# Altium schematic sheet WITH_ADC.SchDoc: ESP32 + INMP441 WLED SHIELD
size A; Revision: 1; SheetNumber: 2; SheetTotal: 2
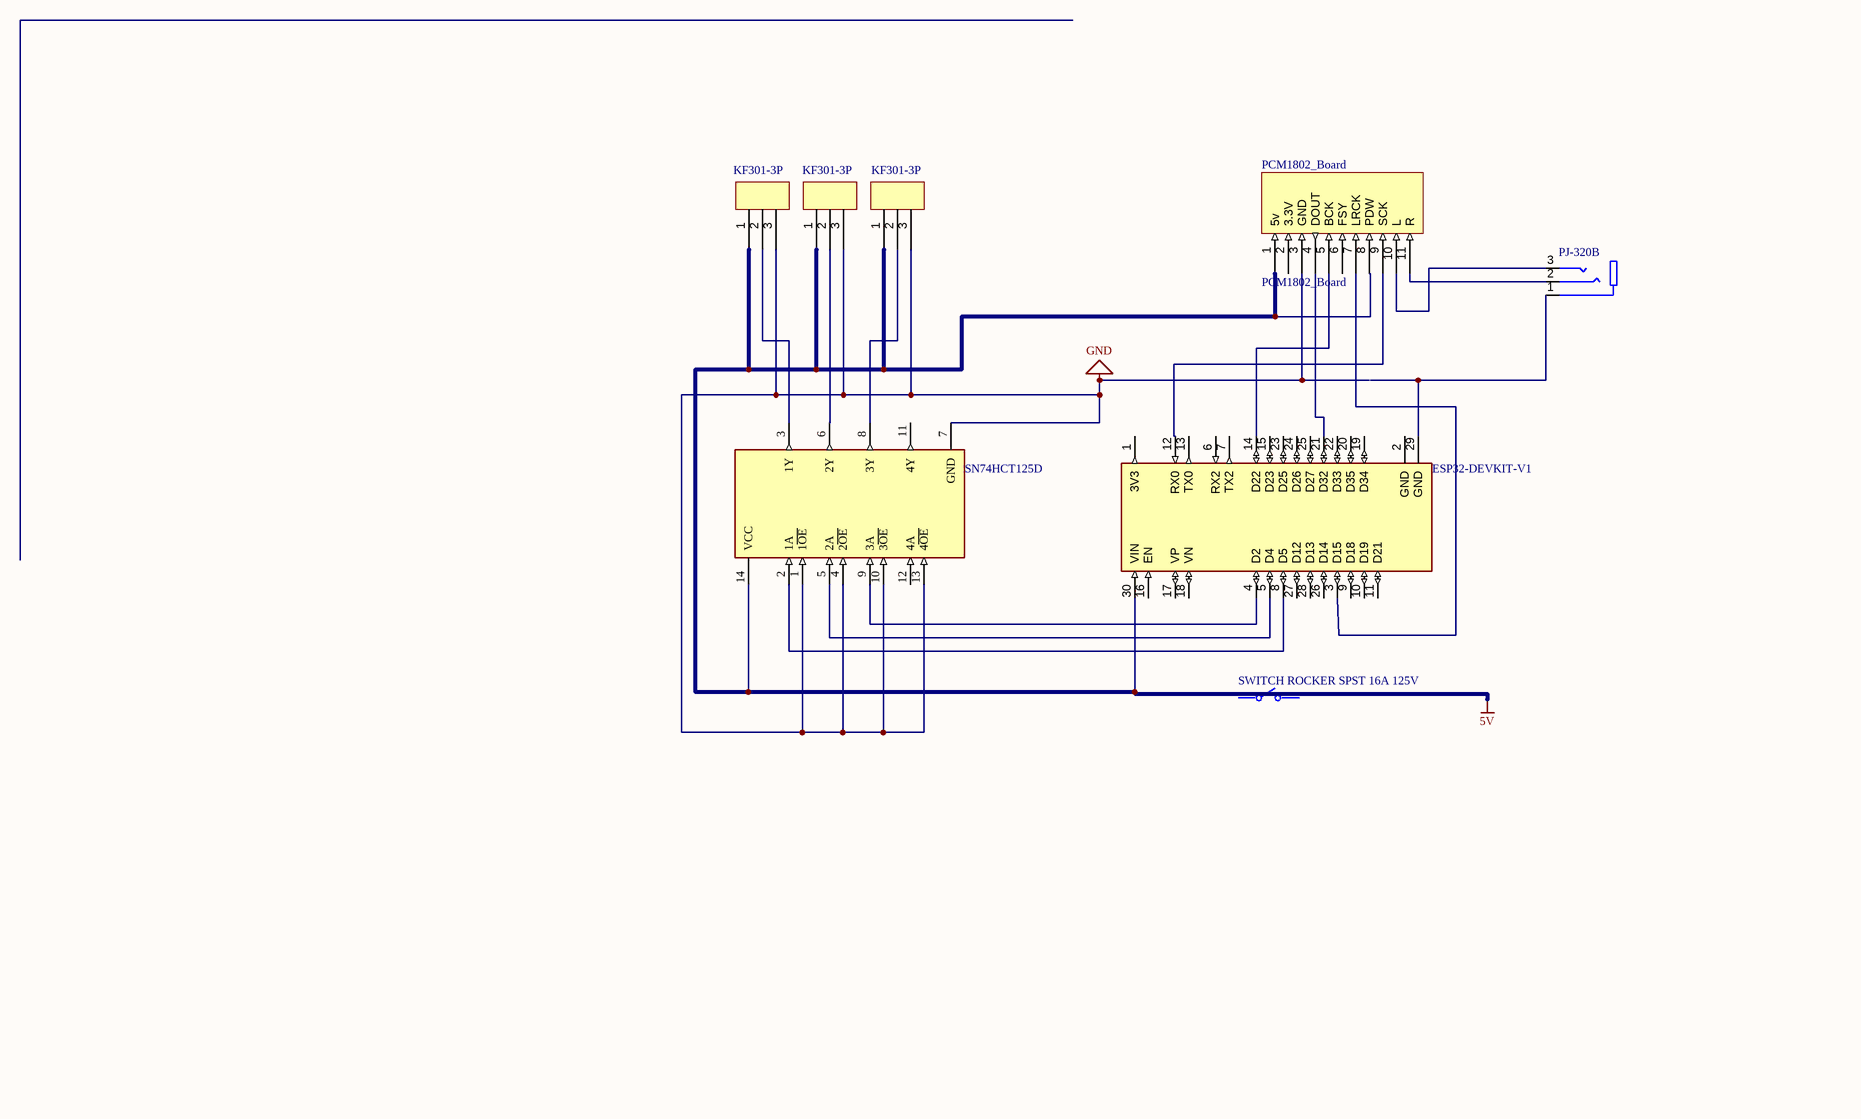
[diagram p0: WITH_ADC.SchDoc]

## Parts
(Parts that share a designator on the sheet are numbered #1, #2 ... from top to bottom, then left to right.)
ESP32-DEVKIT-V1  (no value)  [MODULE_ESP32_DEVKIT_V1]
KF301-3P#1  (no value)  (no BOM)
KF301-3P#2  (no value)  (no BOM)
KF301-3P#3  (no value)  (no BOM)
PCM1802_Board  PCM1802_Board
PJ-320B  (no value)  [BOOMELE_PJ-320B]
SN74HCT125D  (no value)  [FP-D0014A-IPC_C]
SWITCH_ROCKER_SPST_16A_125V  (no value)  [FP-PRASA1-16F-BB0BW-MFG]

## Nets
5V: ESP32-DEVKIT-V1.30(VIN) KF301-3P#1.1 KF301-3P#2.1 KF301-3P#3.1 PCM1802_Board.1(5v) PCM1802_Board.8(PDW) SN74HCT125D.14(VCC)
GND: KF301-3P#1.3 KF301-3P#2.3 KF301-3P#3.3 PCM1802_Board.3(GND) SN74HCT125D.1(1~{OE}) SN74HCT125D.4(2~{OE}) SN74HCT125D.7(GND) SN74HCT125D.10(3~{OE}) SN74HCT125D.13(4~{OE})
NetESP32-DEVKIT-V1_3: ESP32-DEVKIT-V1.3(D15) PCM1802_Board.7(LRCK)
NetESP32-DEVKIT-V1_4: ESP32-DEVKIT-V1.4(D2) SN74HCT125D.9(3A)
NetESP32-DEVKIT-V1_5: ESP32-DEVKIT-V1.5(D4) SN74HCT125D.5(2A)
NetESP32-DEVKIT-V1_8: ESP32-DEVKIT-V1.8(D5) SN74HCT125D.2(1A)
NetESP32-DEVKIT-V1_12: ESP32-DEVKIT-V1.12(RX0) PCM1802_Board.9(SCK)
NetESP32-DEVKIT-V1_14: ESP32-DEVKIT-V1.14(D22) PCM1802_Board.5(BCK)
NetESP32-DEVKIT-V1_21: ESP32-DEVKIT-V1.21(D32) PCM1802_Board.4(DOUT)
NetESP32-DEVKIT-V1_29: ESP32-DEVKIT-V1.29(GND) PJ-320B.1(SLEEVE)
NetKF301-3P#1_2: KF301-3P#1.2 SN74HCT125D.3(1Y)
NetKF301-3P#2_2: KF301-3P#2.2 SN74HCT125D.6(2Y)
NetKF301-3P#3_2: KF301-3P#3.2 SN74HCT125D.8(3Y)
NetPCM1802_Board_10: PCM1802_Board.10(L) PJ-320B.3(TIP)
NetPCM1802_Board_11: PCM1802_Board.11(R) PJ-320B.2(RING)

Not connected (* = marked no-connect by the designer): ESP32-DEVKIT-V1 1(3V3) 2(GND) 6(RX2) 7(TX2) 9(D18) 10(D19) 11(D21) 13(TX0) 15(D23) 16(EN) 17(VP) 18(VN) 19(D34) 20(D35) 22(D33) 23(D25) 24(D26) 25(D27) 26(D14) 27(D12) 28(D13); PCM1802_Board 2(3.3V) 6(FSY); SN74HCT125D 11(4Y) 12(4A)

## Library data of the parts
ESP32-DEVKIT-V1 = ESP32-DEVKIT-V1: Dual core, Wi-Fi: 2.4 GHz up to 150 Mbits/s,BLE (Bluetooth Low Energy) and legacy Bluetooth, 32 bits, Up to 240 MHz; MF: Do it; Price: None; Availability: Not in stock; Package: None; MP: ESP32-DEVKIT-V1; Value: *; SnapEDA_Link: https://www.snapeda.com/parts/ESP32-DEVKIT-V1/Do+it/view-part/?ref=snap; Check_prices: https://www.snapeda.com/parts/ESP32-DEVKIT-V1/Do+it/view-part/?ref=eda
KF301-3P#1-KF301-3P#3 = KF301-3P
PJ-320B = PJ-320B: ÐŸÐ¾Ñ€Ñ‚ Ð´Ð»Ñ Ð½Ð°ÑƒÑˆÐ½Ð¸ÐºÐ¾Ð²; MF: Luoyang Dishang electronics; SnapEDA_Link: https://www.snapeda.com/parts/PJ-320B/Luoyang%20Dishang%20electronics/view-part/5519978/?ref=snap; Value: *; MP: PJ-320B; Availability: Not in stock; Check_prices: https://www.snapeda.com/parts/PJ-320B/Luoyang%20Dishang%20electronics/view-part/5519978/?ref=eda; Package: Package; Price: None
SN74HCT125D = CMP-0440-00009-4: IC BUF NON-INVERT 5.5V 14SOIC; Number of Elements: 4; Logic Function: Buffer; Operating Supply Voltage: 5V; Quiescent Current: 8uA; Polarity: Non-Inverting; Min Supply Voltage: 4.5V; Output Current: 6mA; High Level Output Current: -6mA; Number of Bits per Element: 1; Propagation Delay: 50ns; Output Type: 3-STATE; Mount: Surface Mount; Max Operating Temperature: 85°C; Max Supply Voltage: 5.5V; Width: 3.91mm; REACH SVHC: No SVHC; Number of Input Lines: 4; Min Operating Temperature: -40°C; Length: 8.65mm; Number of Bits: 4; Height: 1.58mm; Number of Circuits: 4; Radiation Hardening: No; Packaging: Rail/Tube; Number of Outputs: 4; RoHS Compliant: Yes; Lead Free: Lead Free; Low Level Output Current: 6mA; Number of Channels: 4; Case/Package: SOIC; Number of Inputs: 4; Series: 74HCT; Number of Pins: 14; Technology: CMOS; Turn-On Delay Time: 50ns; Package Quantity: 50; Number of Output Lines: 4
SWITCH_ROCKER_SPST_16A_125V = CMP-03403-000001-1: SWITCH ROCKER SPST 16A 125V; Manufacturer Part Number: PRASA1-16F-BB0BW; Manufacturer: TE Connectivity; Description: TE CONNECTIVITY / ALCOSWITCH Rocker Switch, Non Illuminated, SPST, On-Off, Black, Panel, 16 A; Voltage Rating Dc: 12V; Electromechanical Life: 100000Cycles; Device Class L3: Rocker Switches; Contact Current Rating: 16A; RoHS: TRUE; Temperature Range High: +85°C; Current Rating: 16A; Category: Switch; Mouser Description: Rocker Switches POWER ROCKER; Temperature Range Low: -20°C; Digikey Description: SWITCH ROCKER SPST 16A 125V; ComponentLink2Description: Datasheet; Lead Free: Yes; Temperature: -20°C to +85°C; Voltage Rating Ac: 125V; ComponentLink2URL: https://www.te.com/commerce/DocumentDelivery/DDEController?Action=srchrtrv&DocNm=1571076&DocType=Customer+Drawing&DocLang=English; Throw Configuration: SPST; Ambient Temperature Range Low: -20°C; Device Class L2: Switches; Automotive: No; Package: 0; Height: 18.4mm; Ambient Temperature Range High: +85°C; Device Class L1: Electromechanical; Octopart: https://octopart.com/prasa1-16f-bb0bw-te+connectivity-40333011